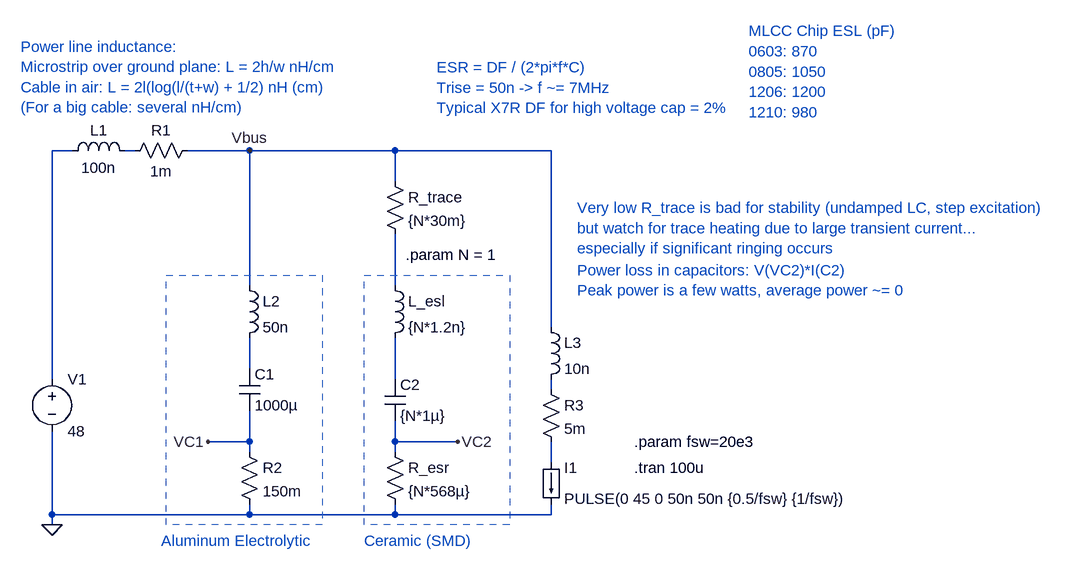
[diagram p0: schematic decoupling.asc]
decoupling.asc, the LTspice schematic file:
Version 4
SHEET 1 1556 680
WIRE -288 48 -320 48
WIRE -192 48 -208 48
WIRE -16 48 -112 48
WIRE 208 48 -16 48
WIRE 448 48 208 48
WIRE 208 96 208 48
WIRE -16 256 -16 48
WIRE 208 256 208 176
WIRE 448 320 448 48
WIRE -16 384 -16 336
WIRE -320 400 -320 48
WIRE 208 400 208 336
WIRE 448 416 448 400
WIRE -16 496 -16 448
WIRE -16 496 -80 496
WIRE 208 496 208 464
WIRE 304 496 208 496
WIRE -16 512 -16 496
WIRE 208 512 208 496
WIRE 448 528 448 496
WIRE -320 608 -320 480
WIRE -16 608 -16 592
WIRE -16 608 -320 608
WIRE 208 608 208 592
WIRE 208 608 -16 608
WIRE 448 608 448 592
WIRE 448 608 208 608
WIRE -320 624 -320 608
FLAG -320 624 0
FLAG -80 496 VC1
FLAG 304 496 VC2
FLAG -16 48 Vbus
SYMBOL ind -304 64 R270
WINDOW 0 32 56 VTop 2
WINDOW 3 5 56 VBottom 2
SYMATTR InstName L1
SYMATTR Value 100n
SYMBOL res -96 32 R90
WINDOW 0 0 56 VBottom 2
WINDOW 3 32 56 VTop 2
SYMATTR InstName R1
SYMATTR Value 1m
SYMBOL load 432 528 R0
WINDOW 123 0 0 Left 2
WINDOW 39 0 0 Left 2
SYMATTR InstName I1
SYMATTR Value PULSE(0 45 0 50n 50n {0.5/fsw} {1/fsw})
SYMBOL voltage -320 384 R0
WINDOW 123 0 0 Left 2
WINDOW 39 0 0 Left 2
SYMATTR InstName V1
SYMATTR Value 48
SYMBOL cap -32 384 R0
SYMATTR InstName C1
SYMATTR Value 1000µ
SYMBOL res -32 496 R0
SYMATTR InstName R2
SYMATTR Value 150m
SYMBOL ind -32 240 R0
SYMATTR InstName L2
SYMATTR Value 50n
SYMBOL cap 192 400 R0
SYMATTR InstName C2
SYMATTR Value {N*1µ}
SYMBOL res 192 496 R0
SYMATTR InstName R_esr
SYMATTR Value {N*568µ}
SYMBOL ind 192 240 R0
SYMATTR InstName L_esl
SYMATTR Value {N*1.2n}
SYMBOL res 192 80 R0
SYMATTR InstName R_trace
SYMATTR Value {N*30m}
SYMBOL ind 432 304 R0
SYMATTR InstName L3
SYMATTR Value 10n
SYMBOL res 432 400 R0
SYMATTR InstName R3
SYMATTR Value 5m
TEXT 576 496 Left 2 !.param fsw=20e3
TEXT 576 536 Left 2 !.tran 100u
TEXT 272 -80 Left 2 ;ESR = DF / (2*pi*f*C) \nTrise = 50n -> f ~= 7MHz  \nTypical X7R DF for high voltage cap = 2%
TEXT 752 -136 Left 2 ;MLCC Chip ESL (pF)\n0603: 870\n0805: 1050\n1206: 1200\n1210: 980
TEXT 224 208 Left 2 !.param N = 1
TEXT 488 232 Left 2 ;Power loss in capacitors: V(VC2)*I(C2)\nPeak power is a few watts, average power ~= 0
TEXT -368 -112 Left 2 ;Power line inductance:\nMicrostrip over ground plane: L = 2h/w nH/cm\nCable in air: L = 2l(log(l/(t+w) + 1/2) nH (cm) \n(For a big cable: several nH/cm)
TEXT 488 136 Left 2 ;Very low R_trace is bad for stability (undamped LC, step excitation)\nbut watch for trace heating due to large transient current...\nespecially if significant ringing occurs
TEXT -152 648 Left 2 ;Aluminum Electrolytic
TEXT 160 648 Left 2 ;Ceramic (SMD)
RECTANGLE Normal 96 624 -144 240 2
RECTANGLE Normal 384 624 160 240 2

The netlist it stands for:
* decoupling.asc
L1 N001 N002 100n
R1 Vbus N002 1m
I1 N007 0 PULSE(0 45 0 50n 50n {0.5/fsw} {1/fsw})
V1 N001 0 48
C1 N004 VC1 1000µ
R2 VC1 0 150m
L2 Vbus N004 50n
C2 N005 VC2 {N*1µ}
R_esr VC2 0 {N*568µ}
L_esl N003 N005 {N*1.2n}
R_trace Vbus N003 {N*30m}
L3 Vbus N006 10n
R3 N006 N007 5m
.param fsw=20e3
.tran 100u
* ESR = DF / (2*pi*f*C)
* Trise = 50n -> f ~= 7MHz
* Typical X7R DF for high voltage cap = 2%
* MLCC Chip ESL (pF)
* 0603: 870
* 0805: 1050
* 1206: 1200
* 1210: 980
.param N = 1
* Power loss in capacitors: V(VC2)*I(C2)
* Peak power is a few watts, average power ~= 0
* Power line inductance:
* Microstrip over ground plane: L = 2h/w nH/cm
* Cable in air: L = 2l(log(l/(t+w) + 1/2) nH (cm)
* (For a big cable: several nH/cm)
* Very low R_trace is bad for stability (undamped LC, step excitation)
* but watch for trace heating due to large transient current...
* especially if significant ringing occurs
* Aluminum Electrolytic
* Ceramic (SMD)
.backanno
.end